# Altium project MotionGlove.PrjPcb
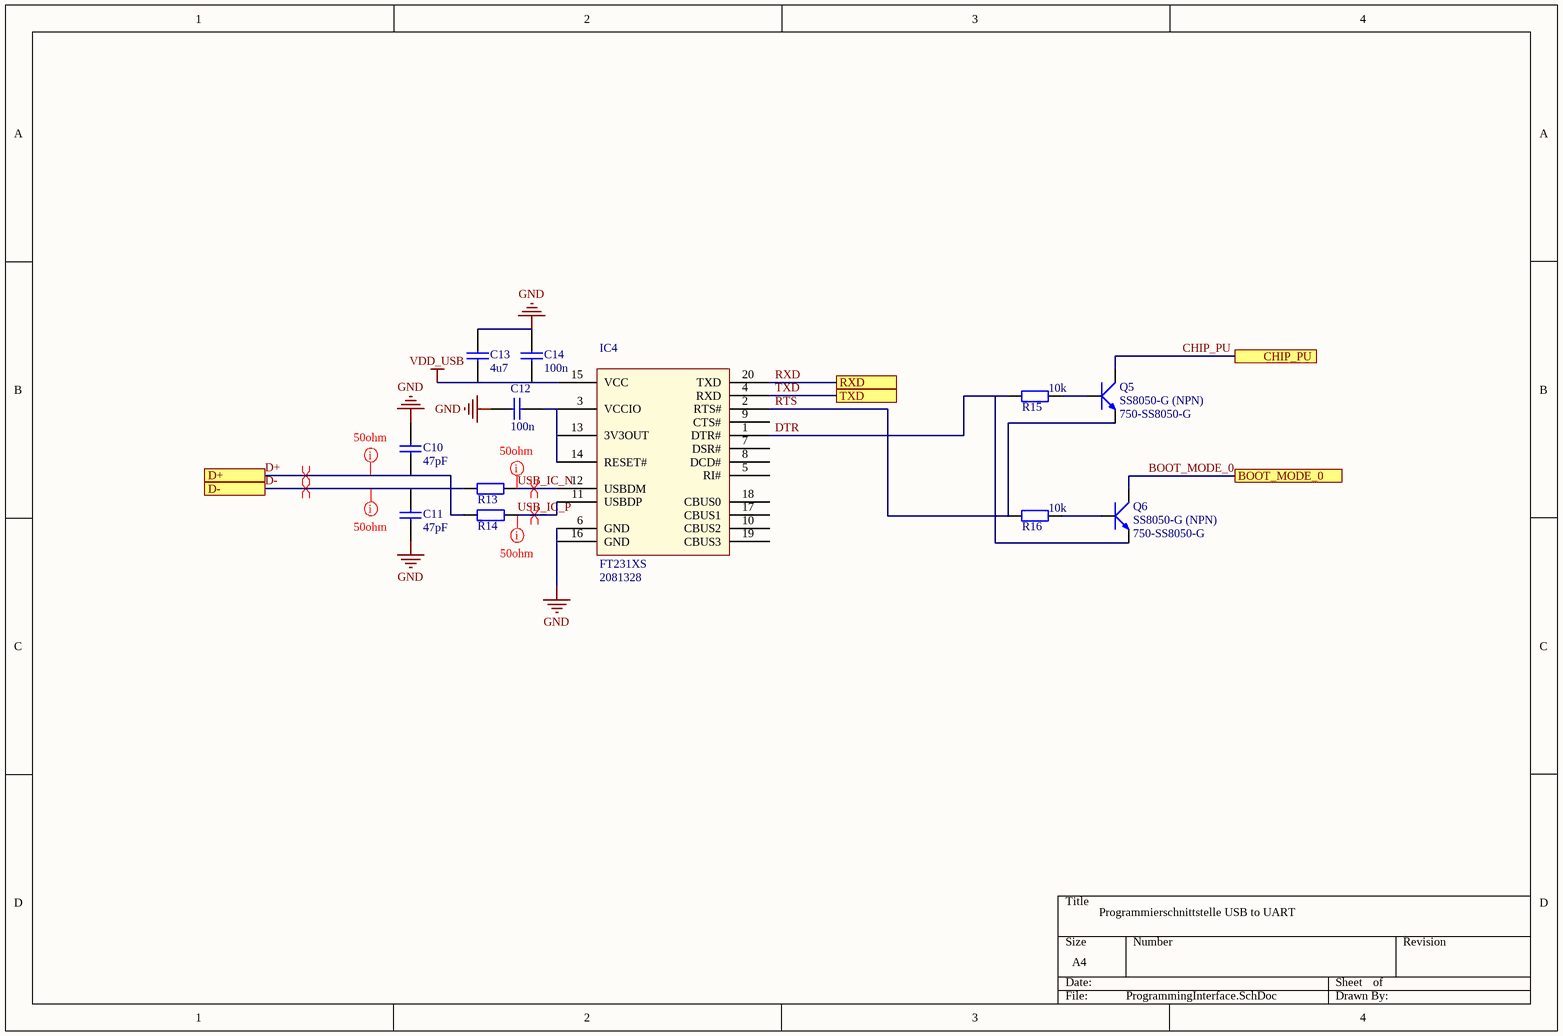
[diagram p0: ProgrammingInterface.SchDoc]
4 sheets, 120 parts. Net scope: flat (ports and power ports of the same name join across sheets).
Board files: MotionGlove.PcbDoc, MotionGlove_Standard_output.PcbDoc
Sheets:
  ProgrammingInterface.SchDoc
  PowerSupply.SchDoc
  ESP32.SchDoc
  MotionGlove.SchDoc

## Sheet ProgrammingInterface.SchDoc
size A4

### Parts
C10  47pF  [CAPC1005X55]
C11  47pF  [CAPC1005X55]
C12  100n  [CAPC1005X55]
C13  4u7  [CAPC1005X55]
C14  100n  [CAPC1005X55]
IC4  FT231XS  Supplier Part Number 1: 2081328  [SOP65P600X175-20]
Q5  SS8050-G (NPN)  Supplier Part Number 1: 750-SS8050-G  [SS8050-G (NPN)]
Q6  SS8050-G (NPN)  Supplier Part Number 1: 750-SS8050-G  [SS8050-G (NPN)]
R13  (no value)  [RESC1005X40]
R14  (no value)  [RESC1005X40]
R15  10k  [RESC1005X40]
R16  10k  [RESC1005X40]

### Ports
BOOT_MODE_0, CHIP_PU, D+, D-, RXD, TXD

### Nets
GND: C10.2 C11.1 C12.1 C13.2 C14.2 IC4.6(GND) IC4.16(GND)
VDD_USB: C13.1 C14.1 IC4.15(VCC)
BOOT_MODE_0: Q6.3(Collector) ; port BOOT_MODE_0
CHIP_PU: Q5.3(Collector) ; port CHIP_PU
D+: C10.1 R14.1 ; port D+
D-: C11.2 R13.1 ; port D-
DTR: IC4.1(DTR#) Q6.2(Emitter) R15.1
RTS: IC4.2(RTS#) Q5.2(Emitter) R16.1
RXD: IC4.20(TXD) ; port RXD
TXD: IC4.4(RXD) ; port TXD
USB_IC_N: IC4.12(USBDM) R13.2
USB_IC_P: IC4.11(USBDP) R14.2
NetC12_2: C12.2 IC4.3(VCCIO) IC4.13(3V3OUT) IC4.14(RESET#)
NetQ5_1: Q5.1(Base) R15.2
NetQ6_1: Q6.1(Base) R16.2

Not connected (* = marked no-connect by the designer): IC4 5(RI#) 7(DSR#) 8(DCD#) 9(CTS#) 10(CBUS2) 17(CBUS1) 18(CBUS0) 19(CBUS3)

### Layout directives
differential pair: D+, D-, USB_IC_N, USB_IC_P
50ohm: Undefined: D+, D-, USB_IC_N, USB_IC_P

### Notes on the sheet
- Programmierschnittstelle USB to UART

### Library data of the parts
C10 C11 = 1076: Manufacturer ID: C0402C470J5GAC; Manufacturer: Kemet; ID: 1076; Type: Standard Ceramic; Value: 47p; Voltage: 50V; Dielectric: Ceramic; Characteristic: NP0; Tolerance: ±5%; UBiKS Number: UBiKS-C00011N; Footprint / Size: C0402; Farnell: 1414592; Unit Price: 0; Quantity: 0; ComponentLink1Description: Website; ComponentLink1URL: http://kemet.com/; ComponentLink2Description: Datasheet; ComponentLink2URL: http://www.kemet.com/kemet/web/homepage/kechome.nsf/vapubfiles/F3102_C0G.pdf/$file/F3102_C0G.pdf
C12 C14 = 1066: Manufacturer ID: C0402C104K4RAC; Manufacturer: Kemet; ID: 1066; Type: Standard Ceramic; Voltage: 16V; Dielectric: Ceramic; Characteristic: X7R; Tolerance: ±15%; UBiKS Number: UBiKS-C00001I; Value: 100n; Footprint / Size: C0402; Farnell: 1288252; Digikey: 399-3521-1-ND; Distributor 3: Mouser; Distributor Number 3: 80-C0402C104K4RAUTO; Unit Price: 0; Quantity: 0; ComponentLink1Description: Website; ComponentLink1URL: http://kemet.com/; ComponentLink2Description: Datasheet; ComponentLink2URL: http://www.kemet.com/kemet/web/homepage/kechome.nsf/vapubfiles/F3102_X7R.pdf/$file/F3102_X7R.pdf
C13 = 1253: Ceramic Chip Capacitor; Manufacturer ID: GRM155R60J475ME47D; Manufacturer: Murata; ID: 1253; Type: Standard Ceramic; Voltage: 6.3V; Characteristic: X5R; Tolerance: ±20%; UBiKS Number: UBiKS-C00140A; Value: 4u7; Dielectric: Ceramic; Footprint / Size: C0402; Farnell: 2426952; ComponentLink1Description: Website; ComponentLink1URL: http://www.murata.com/; ComponentLink2Description: Datasheet; ComponentLink2URL: http://www.farnell.com/datasheets/1769893.pdf
IC4 = 5331: USB to UART; Manufacturer: FTDI; ID: 5331; UBiKS Number: UBiKS-U00288M; Farnell: 2081328; Type: USB; Manufacturer ID: FT231XS; Pins: 20; Footprint / Size: SOP-20; Digikey: 768-1129-1-ND; Distributor Number 3: 895-FT231XS-R; ComponentLink1Description: Website; ComponentLink1URL: http://www.ftdichip.com/; ComponentLink2Description: Datasheet; ComponentLink2URL: http://www.ftdichip.com/Support/Documents/DataSheets/ICs/DS_FT231X.pdf; Supplier 1: Farnell
R13 R14 = 2282: Resistor; Manufacturer ID: MC 0.0625W 0402 1% 27R; Manufacturer: Multicomp; ID: 2282; Value: 27R; Element Type: Thick Film; Tolerance: ±1%; Power rating: 0.063W; Temperatur coeff: ±200ppm/°C; UBiKS Number: UBiKS-R00154S; Type: Standard; Footprint / Size: R0402; Farnell: 1358000; Unit Price: 0; Quantity: 0; ComponentLink1Description: Website; ComponentLink2Description: Datasheet; ComponentLink2URL: http://www.farnell.com/datasheets/318400.pdf
R15 R16 = 2123: Resistor; Manufacturer ID: MC 0.0625W 0402 1% 10K; Manufacturer: Multicomp; ID: 2123; Element Type: Thick Film; Tolerance: ±1%; Power rating: 0.063W; Temperatur coeff: ±100ppm/°C; UBiKS Number: UBiKS-R00007H; Type: Standard; Value: 10k; Footprint / Size: R0402; Farnell: 1358069; ComponentLink1Description: Website; ComponentLink2Description: Datasheet; ComponentLink2URL: http://www.farnell.com/datasheets/318400.pdf
Q5 Q6 = SS8050-G (NPN): Supplier 1: Mouser

## Sheet PowerSupply.SchDoc
size A4
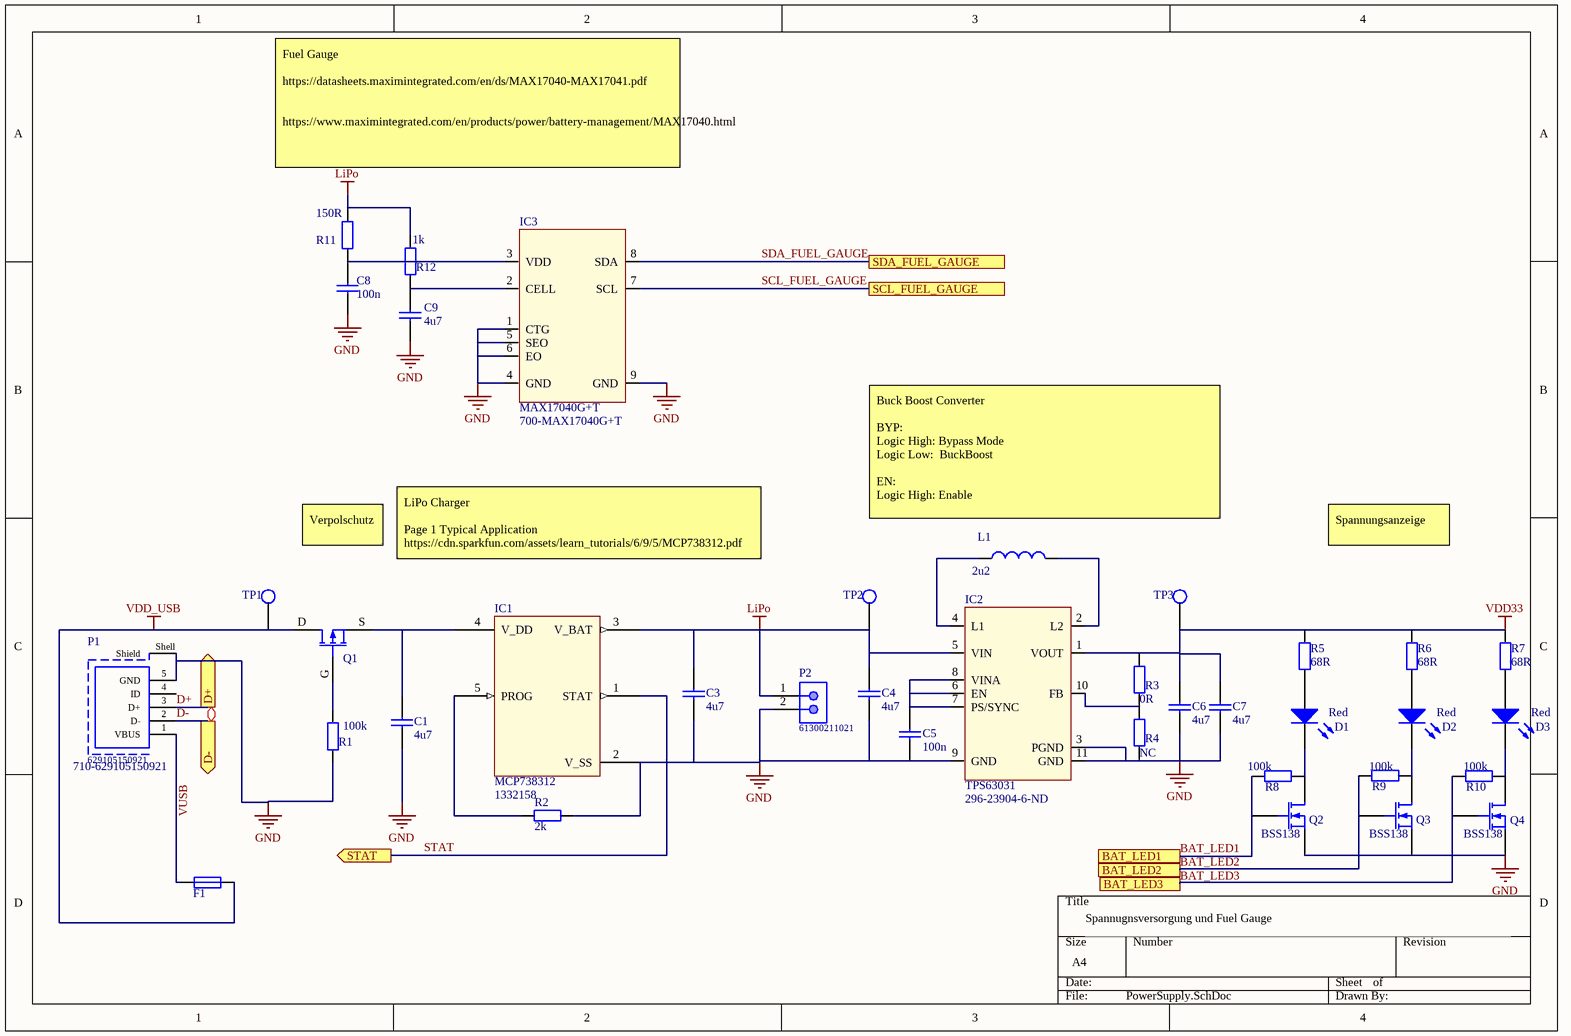
[diagram p1: PowerSupply.SchDoc]

### Parts
C1  4u7  [CAPC1005X55]
C3  4u7  [CAPC1005X55]
C4  4u7  [CAPC1005X55]
C5  100n  [CAPC1005X55]
C6  4u7  [CAPC1005X55]
C7  4u7  [CAPC1005X55]
C8  100n  [CAPC1005X55]
C9  4u7  [CAPC1005X55]
D1  Red  [LEDC2012X90]
D2  Red  [LEDC2012X90]
D3  Red  [LEDC2012X90]
F1  (no value)  [RESC3216X65]
IC1  MCP738312  Supplier Part Number 1: 1332158  [MCP738312]
IC2  TPS63031  Supplier Part Number 1: 296-23904-6-ND  [TPS63031]
IC3  MAX17040G+T  Supplier Part Number 1: 700-MAX17040G+T  [MAX17040G+T]
L1  2u2  [INDM3030X150]
P1  629105150921  Supplier Part Number 1: 710-629105150921  [629105150921]
P2  61300211021  [61300211021]
Q1  IRLML9301TRPBF  [SOT95P240X130_SGD-3]  (value not drawn)
Q2  BSS138  [SOT95P240X130_SGD-3]
Q3  BSS138  [SOT95P240X130_SGD-3]
Q4  BSS138  [SOT95P240X130_SGD-3]
R1  100k  [RESC1005X40]
R2  2k  [RESC1005X40]
R3  0R  [RESC1005X40]
R4  NC  [RESC1005X40]
R5  68R  [RESC1005X40]
R6  68R  [RESC1005X40]
R7  68R  [RESC1005X40]
R8  100k  [RESC1005X40]
R9  100k  [RESC1005X40]
R10  100k  [RESC1005X40]
R11  150R  [RESC1005X40]
R12  1k  [RESC1005X40]
TP1  Testpoint  [TP200A]  (value not drawn)  (no BOM)
TP2  Testpoint  [TP200A]  (value not drawn)  (no BOM)
TP3  Testpoint  [TP200A]  (value not drawn)  (no BOM)

### Ports
BAT_LED1, BAT_LED2, BAT_LED3, D+ (out), D- (out), SCL_FUEL_GAUGE, SDA_FUEL_GAUGE, STAT (out)

### Nets
GND: C1.1 C3.1 C4.1 C5.2 C6.1 C7.1 C8.1 C9.1 IC1.2(V_SS) IC2.3(PGND) IC2.9(GND) IC2.11(GND) IC3.1(CTG) IC3.4(GND) IC3.5(SEO) IC3.6(EO) IC3.9(GND) P1.5(GND) P1.Shell(Shield) P2.2 Q2.S Q3.S Q4.S R1.1 R2.1 R4.1
LiPo: C3.2 C4.2 IC1.3(V_BAT) IC2.5(VIN) P2.1 R11.2 R12.2 TP2.1
VDD33: C6.2 C7.2 IC2.1(VOUT) R3.2 R5.2 R6.2 R7.2 TP3.1
VDD_USB: F1.2 Q1.D TP1.1
BAT_LED1: Q2.G R8.1 ; port BAT_LED1
BAT_LED2: Q3.G R9.1 ; port BAT_LED2
BAT_LED3: Q4.G R10.1 ; port BAT_LED3
D+: P1.3(D+) ; port D+
D-: P1.2(D-) ; port D-
SCL_FUEL_GAUGE: IC3.7(SCL) ; port SCL_FUEL_GAUGE
SDA_FUEL_GAUGE: IC3.8(SDA) ; port SDA_FUEL_GAUGE
STAT: IC1.1(STAT) ; port STAT
NetC1_2: C1.2 IC1.4(V_DD) Q1.S
NetC5_1: C5.1 IC2.6(EN) IC2.7(PS/SYNC) IC2.8(VINA)
NetC8_2: C8.2 IC3.3(VDD) R11.1
NetC9_2: C9.2 IC3.2(CELL) R12.1
NetD1_1: D1.1(K) Q2.D R8.2
NetD1_2: D1.2(A) R5.1
NetD2_1: D2.1(K) Q3.D R9.2
NetD2_2: D2.2(A) R6.1
NetD3_1: D3.1(K) Q4.D R10.2
NetD3_2: D3.2(A) R7.1
NetF1_1: F1.1 P1.1(VBUS)
NetIC1_5: IC1.5(PROG) R2.2
NetIC2_2: IC2.2(L2) L1.2
NetIC2_4: IC2.4(L1) L1.1
NetIC2_10: IC2.10(FB) R3.1 R4.2
NetQ1_G: Q1.G R1.2

Not connected (* = marked no-connect by the designer): P1 4(ID)

### Layout directives
differential pair: D+, D-

### Notes on the sheet
- Fuel Gauge
  https://datasheets.maximintegrated.com/en/ds/MAX17040-MAX17041.pdf
  https://www.maximintegrated.com/en/products/power/battery-management/MAX17040.html
- (near L1) Buck Boost Converter
  BYP:
  Logic High: Bypass Mode
  Logic Low:  BuckBoost
  EN:
  Logic High: Enable
- Verpolschutz
- LiPo Charger
  Page 1 Typical Application
  https://cdn.sparkfun.com/assets/learn_tutorials/6/9/5/MCP738312.pdf
  https://cdn.sparkfun.com/datasheets/Prototyping/USB_LiPolyCharger_SingleCell21.pdf
- Spannungsanzeige
- Spannugnsversorgung und Fuel Gauge
- Labels drawn without touching a wire or pin: VUSB

### Library data of the parts
C1 C9 = 1257: Ceramic Chip Capacitor; Manufacturer ID: C1005X5R1A475K050BC; Manufacturer: TDK; ID: 1257; Type: Standard Ceramic; Voltage: 10V; Characteristic: X5R; Tolerance: ±10%; UBiKS Number: UBiKS-C00144Y; Value: 4u7; Dielectric: Ceramic; Footprint / Size: C0402; Digikey: 445-13820-1-ND; Distributor 3: Mouser; Distributor Number 3: 810-C1005X5R1A475KBC; ComponentLink1Description: Website; ComponentLink1URL: http://product.tdk.com/capacitor/mlcc/detailed_information.php?lang=en&part_no=C1005X5R1A475K050BC; ComponentLink2Description: Datasheet; ComponentLink2URL: http://product.tdk.com/en/catalog/datasheets/mlcc_commercial_general_en.pdf
C3 C4 C6 C7 = 1253: as C13 on sheet ProgrammingInterface; Value: 4u7; Dielectric: Ceramic; Footprint / Size: C0402; Farnell: 2426952; ComponentLink1Description: Website; ComponentLink1URL: http://www.murata.com/; ComponentLink2Description: Datasheet; ComponentLink2URL: http://www.farnell.com/datasheets/1769893.pdf
C5 = 1066: as C12 on sheet ProgrammingInterface; Value: 100n; Footprint / Size: C0402; Farnell: 1288252; Digikey: 399-3521-1-ND; Distributor 3: Mouser; Distributor Number 3: 80-C0402C104K4RAUTO; Unit Price: 0; Quantity: 0; ComponentLink1Description: Website; ComponentLink1URL: http://kemet.com/; ComponentLink2Description: Datasheet; ComponentLink2URL: http://www.kemet.com/kemet/web/homepage/kechome.nsf/vapubfiles/F3102_X7R.pdf/$file/F3102_X7R.pdf
C8 = 1066: Ceramic Chip Capacitor; Manufacturer ID: C0402C104K4RAC; Manufacturer: Kemet; ID: 1066; Type: Standard Ceramic; Voltage: 16V; Characteristic: X7R; Tolerance: ±15%; UBiKS Number: UBiKS-C00001I; Value: 100n; Dielectric: Ceramic; Footprint / Size: C0402; Farnell: 1288252; Digikey: 399-3521-1-ND; Distributor 3: Mouser; Distributor Number 3: 80-C0402C104K4RAUTO; Unit Price: 0; Quantity: 0; ComponentLink1Description: Website; ComponentLink1URL: http://kemet.com/; ComponentLink2Description: Datasheet; ComponentLink2URL: http://www.kemet.com/kemet/web/homepage/kechome.nsf/vapubfiles/F3102_X7R.pdf/$file/F3102_X7R.pdf
D1-D3 = 6010: SMD Chip LED; Manufacturer ID: HSMS-C170; Manufacturer: Avago; ID: 6010; Type: Standard LED; UBiKS Number: UBiKS-V00002H; Color: red; Footprint / Size: LED0805; Farnell: 5790839; ComponentLink1Description: Website; ComponentLink1URL: http://www.avagotech.com/; ComponentLink2Description: Datasheet; ComponentLink2URL: http://www.avagotech.com/docs/AV02-0376EN
F1 = 8021: 0.5A PTC Fuse; Manufacturer ID: 1206L050/15YR; Manufacturer: POLY-FUSE; ID: 8021; UBiKS Number: UBiKS-M00020W; Type: Fuse; Footprint / Size: 3.2mm x 1.6 mm x 0.75mm; Digikey: F3733TR-ND; ComponentLink1Description: Website; ComponentLink1URL: http://www.littelfuse.de/; ComponentLink2Description: Datasheet; ComponentLink2URL: http://www.littelfuse.com/data/en/Data_Sheets/Littelfuse_PTC_1206L.pdf
L1 = 3006: SMD Inductor; Manufacturer ID: NR3015T2R2M; Manufacturer: Taiyo Yuden; ID: 3006; max DC Current: 1.48A; Resistance: 72mR; Tolerance: ± 20%; UBiKS Number: UBiKS-L00005P; Type: Inductor; Value: 2u2; Footprint / Size: IND3x3x1,5mm; Digikey: 587-1648-6-ND; ComponentLink1Description: Website; ComponentLink1URL: http://www.yuden.co.jp/; ComponentLink2Description: Datasheet; ComponentLink2URL: http://www.yuden.co.jp/ut/product/pdf/enr4_e.pdf
P1 = 629105150921: Micro USB 2.0 Type AB Receptacle WR-COM, Horizontal, SMT; Rated Current: 1.8 A; Contact Resistance: 30 mOhm; Working Voltage: 30 VAC; ComponentLink1Description: Manufacturer; ComponentLink1URL: http://www.we-online.de; ComponentLink2Description: Datasheet; ComponentLink2URL: https://katalog.we-online.de/em/datasheet/629105150921.pdf; Part Number: 629105150921; Published Date: September 2018; Publisher: Wurth Elektronik; Orientation: Horizontal; Connector Type: Micro USB 2.0 Type AB; Operating Temperature: -40 to 85 degC; Mounting Technology: SMT; Gender: Receptacle; Packaging: Tape and Reel; Supplier 1: Mouser
P2 = 61300211021: THT Angled Pin Header WR-PHD, Pitch 2.54 mm, Single Row, 2 pins; Pin Number: 2; Pitch: 2.54 mm; Gender: Male; Rated Current: 3 A; Working Voltage: 250 VAC; Withstanding Voltage: 500 VAC; Contact Resistance: 20 mOhm; ComponentLink1Description: Manufacturer; ComponentLink1URL: http://www.we-online.de; ComponentLink2Description: Datasheet; ComponentLink2URL: https://katalog.we-online.de/em/datasheet/6130xx11021.pdf; Part Number: 61300211021; Published Date: August 2018; Publisher: Wurth Elektronik; Operating Temperature: -40 to 105 degC; Mounting Technology: THT; Packaging: Bag; Row Number: Single; Orientation: Angled
Q1 = 4524: P-channel enhancement mode MOS transistor; Manufacturer: International Rectifier; ID: 4524; Type: MOSFET P enh.; UBiKS Number: UBiKS-Q00018R; Manufacturer ID: IRLML9301TRPBF; Footprint / Size: SOT-23; Farnell: 1831089RL; Digikey: IRLML9301TRPBFCT-ND; ComponentLink1Description: Website; ComponentLink1URL: http://www.irf.com; ComponentLink2Description: Datasheet; ComponentLink2URL: http://www.irf.com/product-info/datasheets/data/irlml9301pbf.pdf
Q2-Q4 = 4512: N-channel enhancement mode MOS transistor; Manufacturer: Infineon; ID: 4512; Type: MOSFET N enh.; UBiKS Number: UBiKS-Q00007G; Manufacturer ID: BSS138; Footprint / Size: SOT-23; Farnell: 1156434; ComponentLink1Description: Website; ComponentLink1URL: http://www.infineon.com; ComponentLink2Description: Datasheet; ComponentLink2URL: http://www.farnell.com/datasheets/46045.pdf
R1 R8-R10 = 2121: Resistor; Manufacturer ID: MC 0.0625W 0402 1% 100K; Manufacturer: Multicomp; ID: 2121; Element Type: Thick Film; Tolerance: ±1%; Power rating: 0.063W; Temperatur coeff: ±100ppm/°C; UBiKS Number: UBiKS-R00005V; Type: Standard; Value: 100k; Footprint / Size: R0402; Farnell: 1358096; ComponentLink1Description: Website; ComponentLink2Description: Datasheet; ComponentLink2URL: http://www.farnell.com/datasheets/318400.pdf
R2 = 2144: Resistor; Manufacturer ID: MC 0.0625W 0402 1% 2K; Manufacturer: Multicomp; ID: 2144; Element Type: Thick Film; Tolerance: ±1%; Power rating: 0.063W; Temperatur coeff: ±100ppm/°C; UBiKS Number: UBiKS-R00028X; Type: Standard; Value: 2k; Footprint / Size: R0402; Farnell: 1358050; ComponentLink1Description: Website; ComponentLink2Description: Datasheet; ComponentLink2URL: http://www.farnell.com/datasheets/318400.pdf
R3 = 2117: Resistor; Manufacturer ID: MC 0.0625W 0402 1% 0R; Manufacturer: Multicomp; ID: 2117; Element Type: Thick Film; Tolerance: ±1%; Power rating: 0.063W; Temperatur coeff: ±200ppm/°C; UBiKS Number: UBiKS-R00001X; Type: Standard; Value: 0R; Footprint / Size: R0402; Farnell: 1357983; ComponentLink1Description: Website; ComponentLink2Description: Datasheet; ComponentLink2URL: http://www.farnell.com/datasheets/318400.pdf
R4 = 2117: Resistor; Manufacturer ID: MC 0.0625W 0402 1% 0R; Manufacturer: Multicomp; ID: 2117; Value: 0R; Element Type: Thick Film; Tolerance: ±1%; Power rating: 0.063W; Temperatur coeff: ±200ppm/°C; UBiKS Number: UBiKS-R00001X; Type: Standard; Footprint / Size: R0402; Farnell: 1357983; ComponentLink1Description: Website; ComponentLink2Description: Datasheet; ComponentLink2URL: http://www.farnell.com/datasheets/318400.pdf
R5-R7 = 2292: Resistor; Manufacturer ID: MC 0.0625W 0402 1% 68R; Manufacturer: Multicomp; ID: 2292; Element Type: Thick Film; Tolerance: ±1%; Power rating: 0.063W; Temperatur coeff: ±200ppm/°C; UBiKS Number: UBiKS-R00160Z; Type: Standard; Value: 68R; Footprint / Size: R0402; Farnell: 1358011; Unit Price: 0; Quantity: 0; ComponentLink1Description: Website; ComponentLink2Description: Datasheet; ComponentLink2URL: http://www.farnell.com/datasheets/318400.pdf
R11 = 2219: Resistor; Manufacturer ID: MC 0.0625W 0402 1% 150R; Manufacturer: Multicomp; ID: 2219; Element Type: Thick Film; Tolerance: ±1%; Power rating: 0.063W; Temperatur coeff: ±100ppm/°C; UBiKS Number: UBiKS-R00096U; Type: Standard; Value: 150R; Footprint / Size: R0402; Farnell: 1358020; ComponentLink1Description: Website; ComponentLink2Description: Datasheet; ComponentLink2URL: http://www.farnell.com/datasheets/318400.pdf
R12 = 2154: Resistor; Manufacturer ID: MC 0.0625W 0402 1% 1K; Manufacturer: Multicomp; ID: 2154; Element Type: Thick Film; Tolerance: ±1%; Power rating: 0.063W; Temperatur coeff: ±100ppm/°C; UBiKS Number: UBiKS-R00038C; Type: Standard; Value: 1k; Footprint / Size: R0402; Farnell: 1358043; ComponentLink1Description: Website; ComponentLink2Description: Datasheet; ComponentLink2URL: http://www.farnell.com/datasheets/318400.pdf
TP1-TP3 = 8002: Testpoint 2mm; ID: 8002; UBiKS Number: UBiKS-M00002Y; Type: Testpoint
IC1 = MCP738312: Supplier 1: Farnell
IC2 = TPS63031: Supplier 1: Digi-Key
IC3 = MAX17040G+T: Supplier 1: Mouser

## Sheet ESP32.SchDoc
size A4
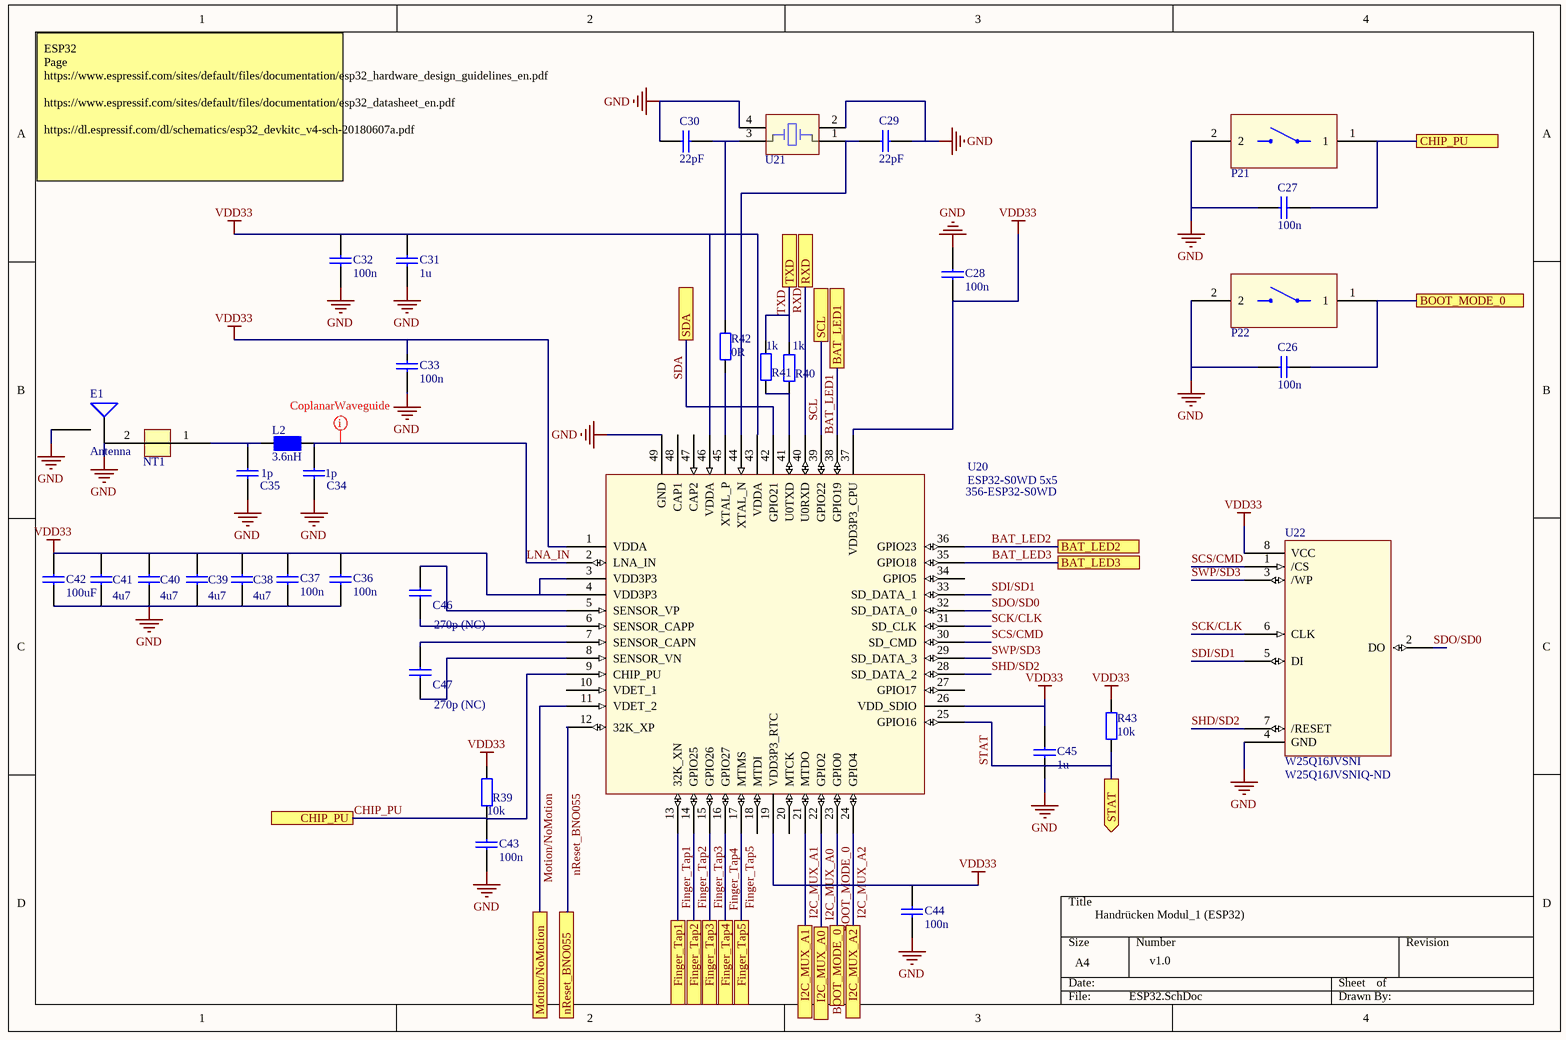
[diagram p2: ESP32.SchDoc]

### Parts
C26  100n  [CAPC1005X55]
C27  100n  [CAPC1005X55]
C28  100n  [CAPC1005X55]
C29  22pF  [CAPC1005X55]
C30  22pF  [CAPC1005X55]
C31  1u  [CAPC1005X55]
C32  100n  [CAPC1005X55]
C33  100n  [CAPC1005X55]
C34  1p  [CAPC2012X100]
C35  1p  [CAPC2012X100]
C36  100n  [CAPC1005X55]
C37  100n  [CAPC1005X55]
C38  4u7  [CAPC1005X55]
C39  4u7  [CAPC1005X55]
C40  4u7  [CAPC1005X55]
C41  4u7  [CAPC1005X55]
C42  100uF  [CAPC3216X180]
C43  100n  [CAPC1005X55]
C44  100n  [CAPC1005X55]
C45  1u  [CAPC1005X55]
C46  270p (NC)  [CAPC1005X55]
C47  270p (NC)  [CAPC1005X55]
E1  Antenna  [Antenna]
L2  3.6nH  [INDC2012X135]
NT1  Net Tie  [NetTie]  (value not drawn)  (net tie, no BOM)
P21  Pushbutton 1 way  [Y35A21120FP]  (value not drawn)
P22  Pushbutton 1 way  [Y35A21120FP]  (value not drawn)
R39  10k  [RESC1005X40]
R40  1k  [RESC1005X40]
R41  1k  [RESC1005X40]
R42  0R  [RESC1005X40]
R43  10k  [RESC1005X40]
U20  ESP32-S0WD 5x5  Supplier Part Number 1: 356-ESP32-S0WD  [ESP32-S0WD 5x5]
U21  40MHz  [OSCCC320X250X70]  (value not drawn)
U22  W25Q16JVSNI  Supplier Part Number 1: W25Q16JVSNIQ-ND  [W25Q16JVSNI]

### Ports
BAT_LED1, BAT_LED2, BAT_LED3, BOOT_MODE_0, CHIP_PU, Finger_Tap1, Finger_Tap2, Finger_Tap3, Finger_Tap4, Finger_Tap5, I2C_MUX_A0, I2C_MUX_A1, I2C_MUX_A2, Motion/NoMotion, nReset_BNO055, RXD, SCL, SDA, STAT (out), TXD

### Nets
GND: C26.2 C27.2 C28.2 C29.2 C30.2 C31.1 C32.1 C33.1 C34.1 C35.1 C36.1 C37.1 C38.1 C39.1 C40.1 C41.1 C42.1 C43.1 C44.1 C45.1 E1.1(input) E1.2(GND) NT1.2 P21.2 P22.2 U20.49(GND) U21.2(GND) U21.4(GND) U22.4(GND)
VDD33: C28.1 C31.2 C32.2 C33.2 C36.2 C37.2 C38.2 C39.2 C40.2 C41.2 C42.2 C44.2 C45.2 R39.2 R43.2 U20.1(VDDA) U20.3(VDD3P3) U20.4(VDD3P3) U20.19(VDD3P3_RTC) U20.26(VDD_SDIO) U20.37(VDD3P3_CPU) U20.43(VDDA) U20.46(VDDA) U22.8(VCC)
BAT_LED1: U20.38(GPIO19) ; port BAT_LED1
BAT_LED2: U20.36(GPIO23) ; port BAT_LED2
BAT_LED3: U20.35(GPIO18) ; port BAT_LED3
BOOT_MODE_0: C26.1 P22.1 U20.23(GPIO0) ; port BOOT_MODE_0
CHIP_PU: C27.1 C43.2 P21.1 R39.1 U20.9(CHIP_PU) ; port CHIP_PU
Finger_Tap1: U20.13(32K_XN) ; port Finger_Tap1
Finger_Tap2: U20.14(GPIO25) ; port Finger_Tap2
Finger_Tap3: U20.15(GPIO26) ; port Finger_Tap3
Finger_Tap4: U20.16(GPIO27) ; port Finger_Tap4
Finger_Tap5: U20.17(MTMS) ; port Finger_Tap5
I2C_MUX_A0: U20.22(GPIO2) ; port I2C_MUX_A0
I2C_MUX_A1: U20.21(MTDO) ; port I2C_MUX_A1
I2C_MUX_A2: U20.24(GPIO4) ; port I2C_MUX_A2
LNA_IN: C34.2 L2.2 U20.2(LNA_IN)
Motion/NoMotion: U20.11(VDET_2) ; port Motion/NoMotion
nReset_BNO055: U20.12(32K_XP) ; port nReset_BNO055
RXD: U20.40(U0RXD) ; port RXD
SCK/CLK: U20.31(SD_CLK) U22.6(CLK)
SCL: U20.39(GPIO22) ; port SCL
SCS/CMD: U20.30(SD_CMD) U22.1(/CS)
SDA: U20.42(GPIO21) ; port SDA
SDI/SD1: U20.33(SD_DATA_1) U22.5(DI)
SDO/SD0: U20.32(SD_DATA_0) U22.2(DO)
SHD/SD2: U20.28(SD_DATA_2) U22.7(/RESET)
STAT: R43.1 U20.25(GPIO16) ; port STAT
SWP/SD3: U20.29(SD_DATA_3) U22.3(/WP)
TXD: R40.2 R41.2 ; port TXD
NetC29_1: C29.1 U20.44(XTAL_N) U21.1(OSC1)
NetC30_1: C30.1 R42.2 U21.3(OSC2)
NetC35_2: C35.2 L2.1 NT1.1
NetC46_1: C46.1 U20.6(SENSOR_CAPP)
NetC46_2: C46.2 U20.5(SENSOR_VP)
NetC47_1: C47.1 U20.8(SENSOR_VN)
NetC47_2: C47.2 U20.7(SENSOR_CAPN)
NetR40_1: R40.1 R41.1 U20.41(U0TXD)
NetR42_1: R42.1 U20.45(XTAL_P)

Not connected (* = marked no-connect by the designer): U20 10(VDET_1) 18(MTDI) 20(MTCK) 27(GPIO17) 34(GPIO5) 47(CAP2) 48(CAP1)

### Layout directives
net class CoplanarWaveguide: LNA_IN

### Notes on the sheet
- ESP32
  Page
  https://www.espressif.com/sites/default/files/documentation/esp32_hardware_design_guidelines_en.pdf
  https://www.espressif.com/sites/default/files/documentation/esp32_datasheet_en.pdf
  https://dl.espressif.com/dl/schematics/esp32_devkitc_v4-sch-20180607a.pdf
- Handrücken Modul_1 (ESP32)
- v1.0

### Library data of the parts
C26-C28 C32 C33 C36 C37 C43 C44 = 1066: as C8 on sheet PowerSupply; Value: 100n; Dielectric: Ceramic; Footprint / Size: C0402; Farnell: 1288252; Digikey: 399-3521-1-ND; Distributor 3: Mouser; Distributor Number 3: 80-C0402C104K4RAUTO; Unit Price: 0; Quantity: 0; ComponentLink1Description: Website; ComponentLink1URL: http://kemet.com/; ComponentLink2Description: Datasheet; ComponentLink2URL: http://www.kemet.com/kemet/web/homepage/kechome.nsf/vapubfiles/F3102_X7R.pdf/$file/F3102_X7R.pdf
C29 C30 = 1085: Ceramic Chip Capacitor; Manufacturer ID: C0402C151J5GAC; Manufacturer: Kemet; ID: 1085; Type: Standard Ceramic; Value: 150p; Voltage: 50V; Characteristic: NP0; Tolerance: ±5%; UBiKS Number: UBiKS-C00020M; Dielectric: Ceramic; Footprint / Size: C0402; Farnell: 1414578; Unit Price: 0; Quantity: 0; ComponentLink1Description: Website; ComponentLink1URL: http://kemet.com/; ComponentLink2Description: Datasheet; ComponentLink2URL: http://www.kemet.com/kemet/web/homepage/kechome.nsf/vapubfiles/F3102_C0G.pdf/$file/F3102_C0G.pdf
C31 C45 = 1079: Ceramic Chip Capacitor; Manufacturer ID: C0402C105K9PAC; Manufacturer: Kemet; ID: 1079; Type: Standard Ceramic; Voltage: 6.3V; Characteristic: X5R; Tolerance: ±10%; UBiKS Number: UBiKS-C00014F; Value: 1u; Dielectric: Ceramic; Footprint / Size: C0402; Farnell: 1288253; Unit Price: 0; Quantity: 0; ComponentLink1Description: Website; ComponentLink1URL: http://kemet.com/; ComponentLink2Description: Datasheet; ComponentLink2URL: http://www.kemet.com/kemet/web/homepage/kechome.nsf/vapubfiles/F3102_X5R.pdf/$file/F3102_X5R.pdf
C34 C35 = 1175: Ceramic Chip Capacitor; Manufacturer ID: C0805C100J5GACTU; Manufacturer: Kemet; ID: 1175; Type: Standard Ceramic; Voltage: 50V; Characteristic: NP0; Tolerance: ±10%; UBiKS Number: UBiKS-C00089S; Value: 1p; Dielectric: Ceramic; Footprint / Size: C0805; Farnell: 1414654; Unit Price: 0; Quantity: 0; ComponentLink1Description: Website; ComponentLink1URL: http://kemet.com/; ComponentLink2Description: Datasheet; ComponentLink2URL: http://www.kemet.com/kemet/web/homepage/kechome.nsf/vapubfiles/F3102_C0G.pdf/$file/F3102_C0G.pdf
C38-C41 = 1253: Manufacturer ID: GRM155R60J475ME47D; Manufacturer: Murata; ID: 1253; Type: Standard Ceramic; Voltage: 6.3V; Dielectric: Ceramic; Characteristic: X5R; Tolerance: ±20%; UBiKS Number: UBiKS-C00140A; Value: 4u7; Footprint / Size: C0402; Farnell: 2426952; ComponentLink1Description: Website; ComponentLink1URL: http://www.murata.com/; ComponentLink2Description: Datasheet; ComponentLink2URL: http://www.farnell.com/datasheets/1769893.pdf
C42 = 1250: Manufacturer ID: GRM31CR60J107ME39L; Manufacturer: Murata; ID: 1250; Type: Standard Ceramic; Value: 100u; Voltage: 6.3V; Dielectric: Ceramic; Characteristic: X5R; Tolerance: ±20%; UBiKS Number: UBiKS-C00137L; Footprint / Size: C1206; Farnell: 1735535; Digikey: 490-4539-1-ND; ComponentLink1Description: Website; ComponentLink1URL: http://www.murata.com/; ComponentLink2Description: Datasheet; ComponentLink2URL: http://search.murata.co.jp/Ceramy/image/img/A01X/G101/ENG/GRM31CR60J107ME39-01.pdf
C46 C47 = 1218: Ceramic Chip Capacitor; Manufacturer ID: C0402C271J5GAC; Manufacturer: Kemet; ID: 1218; Type: Standard Ceramic; Voltage: 50V; Characteristic: NP0; Tolerance: ±5%; UBiKS Number: UBiKS-C00124O; Value: 270p; Dielectric: Ceramic; Footprint / Size: C0402; Farnell: 1414585; Unit Price: 0; Quantity: 0; ComponentLink1Description: Website; ComponentLink1URL: http://kemet.com/; ComponentLink2Description: Datasheet; ComponentLink2URL: http://www.kemet.com/kemet/web/homepage/kechome.nsf/vapubfiles/F3102_C0G.pdf/$file/F3102_C0G.pdf
E1 = Antenna: Antenna (Chip)
L2 = 3012: Chip Ferrit Bead Impedanz 220R; Manufacturer ID: FBMH2012HM221-T; Manufacturer: Taiyo Yuden; ID: 3012; max DC Current: 2A; Resistance: 60mR; Tolerance: ± 25%; UBiKS Number: UBiKS-L00009N; Type: Ferrit Bead; Value: 3.6nH; Footprint / Size: IND0805; Farnell: 1611985; Digikey: 587-1748-1-ND; ComponentLink1Description: Website; ComponentLink1URL: http://www.yuden.co.jp/; ComponentLink2Description: Datasheet; ComponentLink2URL: http://www.yuden.co.jp/us/product/pdf/efbm_e.pdf
NT1 = NetTie
P21 P22 = 7004: Manufacturer ID: Y35A21110FPLFS; Manufacturer: C&K; ID: 7004; UBiKS Number: UBiKS-S00003K; Type: Pushbutton; Distributor 3: RS; Distributor Number 3: 102-377; ComponentLink1Description: Website; ComponentLink1URL: http://www.ck-components.com; ComponentLink2Description: Datasheet; ComponentLink2URL: \\lift\sct-software\altium\sct-svn\0900766b80c5f4ae.pdf
R39 R43 = 2123: as R15 on sheet ProgrammingInterface; Type: Standard; Value: 10k; Footprint / Size: R0402; Farnell: 1358069; ComponentLink1Description: Website; ComponentLink2Description: Datasheet; ComponentLink2URL: http://www.farnell.com/datasheets/318400.pdf
R40 R41 = 2154: as R12 on sheet PowerSupply; Type: Standard; Value: 1k; Footprint / Size: R0402; Farnell: 1358043; ComponentLink1Description: Website; ComponentLink2Description: Datasheet; ComponentLink2URL: http://www.farnell.com/datasheets/318400.pdf
R42 = 2117: as R3 on sheet PowerSupply; Type: Standard; Value: 0R; Footprint / Size: R0402; Farnell: 1357983; ComponentLink1Description: Website; ComponentLink2Description: Datasheet; ComponentLink2URL: http://www.farnell.com/datasheets/318400.pdf
U21 = 9048: Ultra Miniature Ceranic SMD Crystal; Manufacturer ID: ABM8-40.000MHZ-B2-T; Manufacturer: Abracon; ID: 9048; UBiKS Number: UBiKS-X00038I; Type: Crystal; Value: 40MHz; Footprint / Size: XTAL3.2 x 2.5; Digikey: 535-9147-1-ND; Distributor 3: Mouser; Distributor Number 3: 815-ABM8-40-B2-T; ComponentLink1Description: Website; ComponentLink1URL: http://www.abracon.com/; ComponentLink2Description: Datasheet; ComponentLink2URL: http://www.abracon.com/Resonators/abm8.pdf
U20 = ESP32-S0WD 5x5: Supplier 1: Mouser
U22 = W25Q16JVSNI: Supplier 1: Digi-Key

## Sheet MotionGlove.SchDoc
size A3
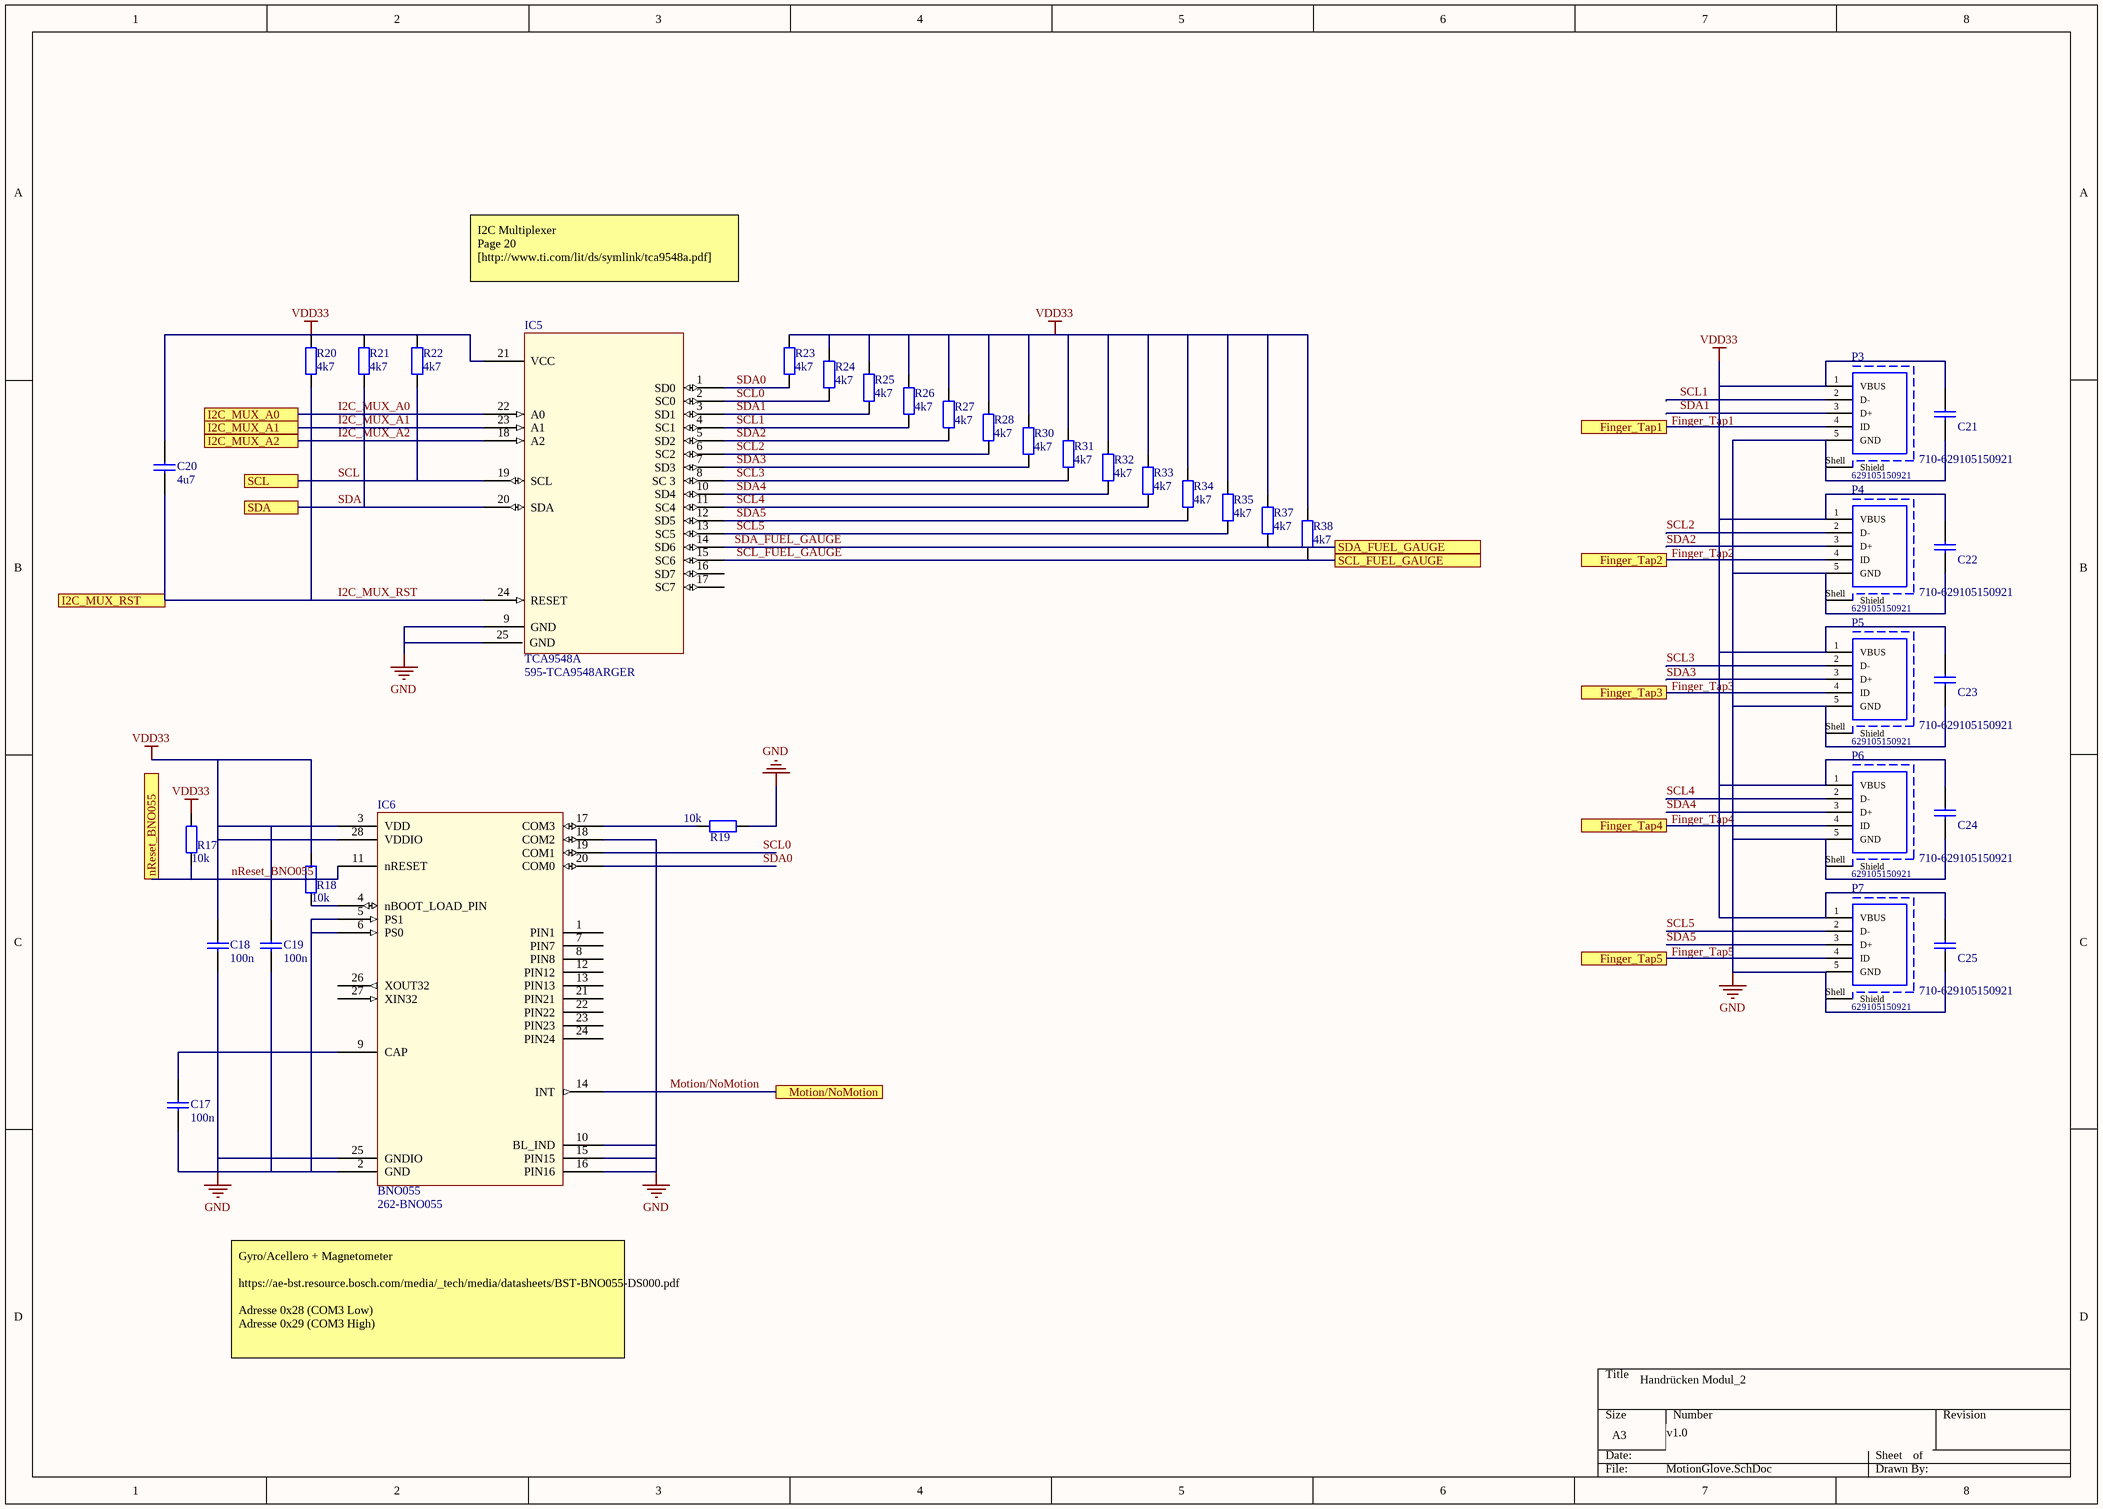
[diagram p3: MotionGlove.SchDoc]

### Parts
C17  100n  [CAPC1005X55]
C18  100n  [CAPC1005X55]
C19  100n  [CAPC1005X55]
C20  4u7  [CAPC1005X55]
C21  100n  [CAPC1005X55]  (value not drawn)
C22  100n  [CAPC1005X55]  (value not drawn)
C23  100n  [CAPC1005X55]  (value not drawn)
C24  100n  [CAPC1005X55]  (value not drawn)
C25  100n  [CAPC1005X55]  (value not drawn)
IC5  TCA9548A  Supplier Part Number 1: 595-TCA9548ARGER  [TCA9548A-Q1]
IC6  BNO055  Supplier Part Number 1: 262-BNO055  [BNO055]
P3  629105150921  Supplier Part Number 1: 710-629105150921  [629105150921]
P4  629105150921  Supplier Part Number 1: 710-629105150921  [629105150921]
P5  629105150921  Supplier Part Number 1: 710-629105150921  [629105150921]
P6  629105150921  Supplier Part Number 1: 710-629105150921  [629105150921]
P7  629105150921  Supplier Part Number 1: 710-629105150921  [629105150921]
R17  10k  [RESC1005X40]
R18  10k  [RESC1005X40]
R19  10k  [RESC1005X40]
R20  4k7  [RESC1005X40]
R21  4k7  [RESC1005X40]
R22  4k7  [RESC1005X40]
R23  4k7  [RESC1005X40]
R24  4k7  [RESC1005X40]
R25  4k7  [RESC1005X40]
R26  4k7  [RESC1005X40]
R27  4k7  [RESC1005X40]
R28  4k7  [RESC1005X40]
R30  4k7  [RESC1005X40]
R31  4k7  [RESC1005X40]
R32  4k7  [RESC1005X40]
R33  4k7  [RESC1005X40]
R34  4k7  [RESC1005X40]
R35  4k7  [RESC1005X40]
R37  4k7  [RESC1005X40]
R38  4k7  [RESC1005X40]

### Ports
Finger_Tap1, Finger_Tap2, Finger_Tap3, Finger_Tap4, Finger_Tap5, I2C_MUX_A0, I2C_MUX_A1, I2C_MUX_A2, I2C_MUX_RST, Motion/NoMotion, nReset_BNO055, SCL, SCL_FUEL_GAUGE, SDA, SDA_FUEL_GAUGE

### Nets
GND: C17.1 C18.1 C19.1 C21.1 C22.1 C23.1 C24.1 C25.1 IC5.9(GND) IC5.25(GND) IC6.2(GND) IC6.5(PS1) IC6.6(PS0) IC6.10(BL_IND) IC6.15(PIN15) IC6.16(PIN16) IC6.18(COM2) IC6.25(GNDIO) P3.5(GND) P3.Shell(Shield) P4.5(GND) P4.Shell(Shield) P5.5(GND) P5.Shell(Shield) P6.5(GND) P6.Shell(Shield) P7.5(GND) P7.Shell(Shield) R19.2
VDD33: C18.2 C19.2 C20.2 C21.2 C22.2 C23.2 C24.2 C25.2 IC5.21(VCC) IC6.3(VDD) IC6.28(VDDIO) P3.1(VBUS) P4.1(VBUS) P5.1(VBUS) P6.1(VBUS) P7.1(VBUS) R17.2 R18.2 R20.2 R21.2 R22.2 R23.2 R24.2 R25.2 R26.2 R27.2 R28.2 R30.2 R31.2 R32.2 R33.2 R34.2 R35.2 R37.2 R38.2
Finger_Tap1: P3.4(ID) ; port Finger_Tap1
Finger_Tap2: P4.4(ID) ; port Finger_Tap2
Finger_Tap3: P5.4(ID) ; port Finger_Tap3
Finger_Tap4: P6.4(ID) ; port Finger_Tap4
Finger_Tap5: P7.4(ID) ; port Finger_Tap5
I2C_MUX_A0: IC5.22(A0) ; port I2C_MUX_A0
I2C_MUX_A1: IC5.23(A1) ; port I2C_MUX_A1
I2C_MUX_A2: IC5.18(A2) ; port I2C_MUX_A2
I2C_MUX_RST: C20.1 IC5.24(RESET) R20.1 ; port I2C_MUX_RST
Motion/NoMotion: IC6.14(INT) ; port Motion/NoMotion
nReset_BNO055: IC6.11(nRESET) R17.1 ; port nReset_BNO055
SCL: IC5.19(SCL) R22.1 ; port SCL
SCL0: IC5.2(SC0) IC6.19(COM1) R24.1
SCL1: IC5.4(SC1) P3.2(D-) R26.1
SCL2: IC5.6(SC2) P4.2(D-) R28.1
SCL3: IC5.8(SC_3) P5.2(D-) R31.1
SCL4: IC5.11(SC4) P6.2(D-) R33.1
SCL5: IC5.13(SC5) P7.2(D-) R35.1
SCL_FUEL_GAUGE: IC5.15(SC6) R38.1 ; port SCL_FUEL_GAUGE
SDA: IC5.20(SDA) R21.1 ; port SDA
SDA0: IC5.1(SD0) IC6.20(COM0) R23.1
SDA1: IC5.3(SD1) P3.3(D+) R25.1
SDA2: IC5.5(SD2) P4.3(D+) R27.1
SDA3: IC5.7(SD3) P5.3(D+) R30.1
SDA4: IC5.10(SD4) P6.3(D+) R32.1
SDA5: IC5.12(SD5) P7.3(D+) R34.1
SDA_FUEL_GAUGE: IC5.14(SD6) R37.1 ; port SDA_FUEL_GAUGE
NetC17_2: C17.2 IC6.9(CAP)
NetIC6_4: IC6.4(nBOOT_LOAD_PIN) R18.1
NetIC6_17: IC6.17(COM3) R19.1

Not connected (* = marked no-connect by the designer): IC5 16(SD7) 17(SC7); IC6 1(PIN1) 7(PIN7) 8(PIN8) 12(PIN12) 13(PIN13) 21(PIN21) 22(PIN22) 23(PIN23) 24(PIN24) 26(XOUT32) 27(XIN32)

### Notes on the sheet
- I2C Multiplexer
  Page 20
  [http://www.ti.com/lit/ds/symlink/tca9548a.pdf]
  anschauen
  http://www.ti.com/lit/ds/symlink/pca9544a.pdf
- Gyro/Acellero + Magnetometer
  https://ae-bst.resource.bosch.com/media/_tech/media/datasheets/BST-BNO055-DS000.pdf
  Adresse 0x28 (COM3 Low)
  Adresse 0x29 (COM3 High)
- Handrücken Modul_2
- v1.0
- Labels drawn without touching a wire or pin: Finger_Tap1, Finger_Tap2, Finger_Tap3, Finger_Tap4, Finger_Tap5

### Library data of the parts
C17-C19 C21-C25 = 1066: as C8 on sheet PowerSupply; Value: 100n; Dielectric: Ceramic; Footprint / Size: C0402; Farnell: 1288252; Digikey: 399-3521-1-ND; Distributor 3: Mouser; Distributor Number 3: 80-C0402C104K4RAUTO; Unit Price: 0; Quantity: 0; ComponentLink1Description: Website; ComponentLink1URL: http://kemet.com/; ComponentLink2Description: Datasheet; ComponentLink2URL: http://www.kemet.com/kemet/web/homepage/kechome.nsf/vapubfiles/F3102_X7R.pdf/$file/F3102_X7R.pdf
C20 = 1253: as C13 on sheet ProgrammingInterface; Value: 4u7; Dielectric: Ceramic; Footprint / Size: C0402; Farnell: 2426952; ComponentLink1Description: Website; ComponentLink1URL: http://www.murata.com/; ComponentLink2Description: Datasheet; ComponentLink2URL: http://www.farnell.com/datasheets/1769893.pdf
P3-P7 = 629105150921: as P1 on sheet PowerSupply; ComponentLink1Description: Manufacturer; ComponentLink1URL: http://www.we-online.de; ComponentLink2Description: Datasheet; ComponentLink2URL: https://katalog.we-online.de/em/datasheet/629105150921.pdf; Part Number: 629105150921; Published Date: September 2018; Publisher: Wurth Elektronik; Orientation: Horizontal; Connector Type: Micro USB 2.0 Type AB; Operating Temperature: -40 to 85 degC; Mounting Technology: SMT; Gender: Receptacle; Packaging: Tape and Reel; Supplier 1: Mouser
R17-R19 = 2123: as R15 on sheet ProgrammingInterface; Type: Standard; Value: 10k; Footprint / Size: R0402; Farnell: 1358069; ComponentLink1Description: Website; ComponentLink2Description: Datasheet; ComponentLink2URL: http://www.farnell.com/datasheets/318400.pdf
R20-R28 R30-R35 R37 R38 = 2131: Resistor; Manufacturer ID: MC 0.0625W 0402 1% 4K7; Manufacturer: Multicomp; ID: 2131; Element Type: Thick Film; Tolerance: ±1%; Power rating: 0.063W; Temperatur coeff: ±100ppm/°C; UBiKS Number: UBiKS-R00015A; Type: Standard; Value: 4k7; Footprint / Size: R0402; Farnell: 1358060; ComponentLink1Description: Website; ComponentLink2Description: Datasheet; ComponentLink2URL: http://www.farnell.com/datasheets/318400.pdf
IC5 = TCA9548A: Supplier 1: Mouser
IC6 = BNO055: Supplier 1: Mouser

## Nets that join several sheets
GND: ProgrammingInterface (7 pins), PowerSupply (26 pins), ESP32 (29 pins), MotionGlove (29 pins)
VDD33: PowerSupply (8 pins), ESP32 (24 pins), MotionGlove (35 pins)
VDD_USB: ProgrammingInterface (C13.1 C14.1 IC4.15), PowerSupply (F1.2 Q1.D TP1.1)
BAT_LED1: PowerSupply (Q2.G R8.1), ESP32 (U20.38)
BAT_LED2: PowerSupply (Q3.G R9.1), ESP32 (U20.36)
BAT_LED3: PowerSupply (Q4.G R10.1), ESP32 (U20.35)
BOOT_MODE_0: ProgrammingInterface (Q6.3), ESP32 (C26.1 P22.1 U20.23)
CHIP_PU: ProgrammingInterface (Q5.3), ESP32 (5 pins)
D+: ProgrammingInterface (C10.1 R14.1), PowerSupply (P1.3)
D-: ProgrammingInterface (C11.2 R13.1), PowerSupply (P1.2)
Finger_Tap1: ESP32 (U20.13), MotionGlove (P3.4)
Finger_Tap2: ESP32 (U20.14), MotionGlove (P4.4)
Finger_Tap3: ESP32 (U20.15), MotionGlove (P5.4)
Finger_Tap4: ESP32 (U20.16), MotionGlove (P6.4)
Finger_Tap5: ESP32 (U20.17), MotionGlove (P7.4)
I2C_MUX_A0: ESP32 (U20.22), MotionGlove (IC5.22)
I2C_MUX_A1: ESP32 (U20.21), MotionGlove (IC5.23)
I2C_MUX_A2: ESP32 (U20.24), MotionGlove (IC5.18)
Motion/NoMotion: ESP32 (U20.11), MotionGlove (IC6.14)
nReset_BNO055: ESP32 (U20.12), MotionGlove (IC6.11 R17.1)
RXD: ProgrammingInterface (IC4.20), ESP32 (U20.40)
SCL: ESP32 (U20.39), MotionGlove (IC5.19 R22.1)
SCL_FUEL_GAUGE: PowerSupply (IC3.7), MotionGlove (IC5.15 R38.1)
SDA: ESP32 (U20.42), MotionGlove (IC5.20 R21.1)
SDA_FUEL_GAUGE: PowerSupply (IC3.8), MotionGlove (IC5.14 R37.1)
STAT: PowerSupply (IC1.1), ESP32 (R43.1 U20.25)
TXD: ProgrammingInterface (IC4.4), ESP32 (R40.2 R41.2)

## Assembly variants
Standard: all parts fitted